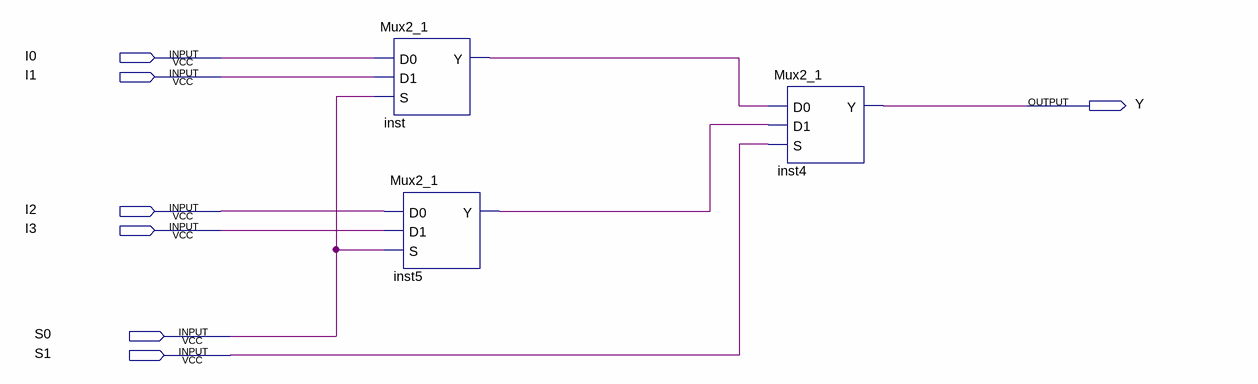
[diagram p0: schematic sheet]
// Quartus schematic Mux4_1.bdf as structural Verilog: 3 symbols, 7 pins
module Mux4_1 (
  input  I0,
  input  I1,
  input  I2,
  input  I3,
  input  S0,
  input  S1,
  output Y
);

  wire inst5_y, inst_y;

  Mux2_1 inst (.D0(I0), .D1(I1), .S(S0), .Y(inst_y));
  Mux2_1 inst5 (.D0(I2), .D1(I3), .S(S0), .Y(inst5_y));
  Mux2_1 inst4 (.D0(inst_y), .D1(inst5_y), .S(S1), .Y(Y));
endmodule
